# Altium schematic sheet Accelerometre.SchDoc
size A4; Author: Jérémie Jean-Elie; SheetNumber: 7; SheetTotal: 7; Version: E
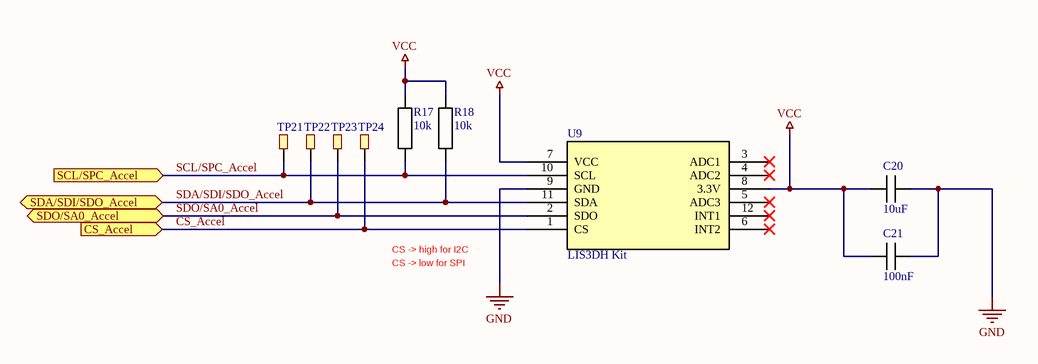
[diagram p0: Accelerometre.SchDoc]

## Parts
C20  10uF  [CAPC1608X08M]
C21  100nF  [CAPC1608X08M]
R17  10k  [RESC1608X06M]
R18  10k  [RESC1608X06M]
TP21  TestPoint  [KEYSTONE_5019]  (value not drawn)
TP22  TestPoint  [KEYSTONE_5019]  (value not drawn)
TP23  TestPoint  [KEYSTONE_5019]  (value not drawn)
TP24  TestPoint  [KEYSTONE_5019]  (value not drawn)
U9  LIS3DH Kit  [LIS3DH_Kit]

## Ports
CS_Accel (in, see Schema_bloc[3A], Microcontroleur[4B]), SCL/SPC_Accel (in, see Schema_bloc[3A], Microcontroleur[1C]), SDA/SDI/SDO_Accel (bidir, see Schema_bloc[3A], Microcontroleur[1C]), SDO/SA0_Accel (bidir, see Schema_bloc[3A], Microcontroleur[1C])

## Nets
GND: C20.2 C21.2 U9.9(GND)
VCC: C20.1 C21.1 R17.2 R18.2 U9.7(VCC) U9.8(3.3V)
CS_Accel: TP24.1 U9.1(CS) ; port CS_Accel
SCL/SPC_Accel: R17.1 TP21.1 U9.10(SCL) ; port SCL/SPC_Accel
SDA/SDI/SDO_Accel: R18.1 TP22.1 U9.11(SDA) ; port SDA/SDI/SDO_Accel
SDO/SA0_Accel: TP23.1 U9.2(SDO) ; port SDO/SA0_Accel

Not connected (* = marked no-connect by the designer): U9 3(ADC1)* 4(ADC2)* 5(ADC3)* 6(INT2)* 12(INT1)*

## Notes on the sheet
- CS -> high for I2C
- CS -> low for SPI
- Fichier :
- a
- Date :
- Heure :
- Version :
- Auteur :
- Modif.
- b
- c
- d
- Projet :
- No :
- Nb feuilles
- Feuille n°
- Chemin :

## Library data of the parts
C20 = CMP-065-000003-2: CAPC 10uF X5R 10V 20% 1608 (0603 INCH); Manufacturer: TDK; Manufacturer Number: C1608X5R1A106M080AC; TemperatureRange: -55°C to +85°C; IsStocked: 1; Value: 10µF; PN: PN-131657; Supplier Price 1: 0.0944; Tolerance: ±20%; Category: Passives; Dielectric: X5R; SubCategory: Condensateurs ceramique; Supplier 1: ETML; Voltage: 10V; Supplier Part Number 1: FAB.0603_C 10uF
C21 = CMP-065-000000-2: CAPC 100nF X7R 50V 10% 1608 (0603 INCH); Manufacturer: TDK; Manufacturer Number: CGA3E2X7R1H104K080AA; IsStocked: 1; PN: PN-338083; Current: NULL; TemperatureRange: -55°C to +125°C; Voltage: 50V; Dielectric: X7R; Value: 100nF; Category: Passives; Supplier Price 1: 0.0100; Supplier Part Number 1: FAB.0603_C 100n; SubCategory: Condensateurs ceramique; Tolerance: ±10%; Supplier 1: ETML; TemperatureCoeff: NULL; Power: NULL
R17 R18 = CMP-066-000124-2: RES 10kohm  ±1% 0.1W  1608 (0603 INCH); Manufacturer Number: RC0603FR-0710KL; Manufacturer: Yageo; TemperatureRange: -55°C to 155°C; Voltage: 75V; TemperatureCoeff: ±100ppm/°C; PN: PN-896786; IsStocked: 1; Category: Passives; Tolerance: ±1%; Value: 10k; Supplier Part Number 1: FAB.0603_R 10k; Power: 0.1W; Supplier Price 1: 0.0200; Supplier 1: ETML; SubCategory: Resistances couche epaisse